# Altium project PocketPlayer.PrjPcb
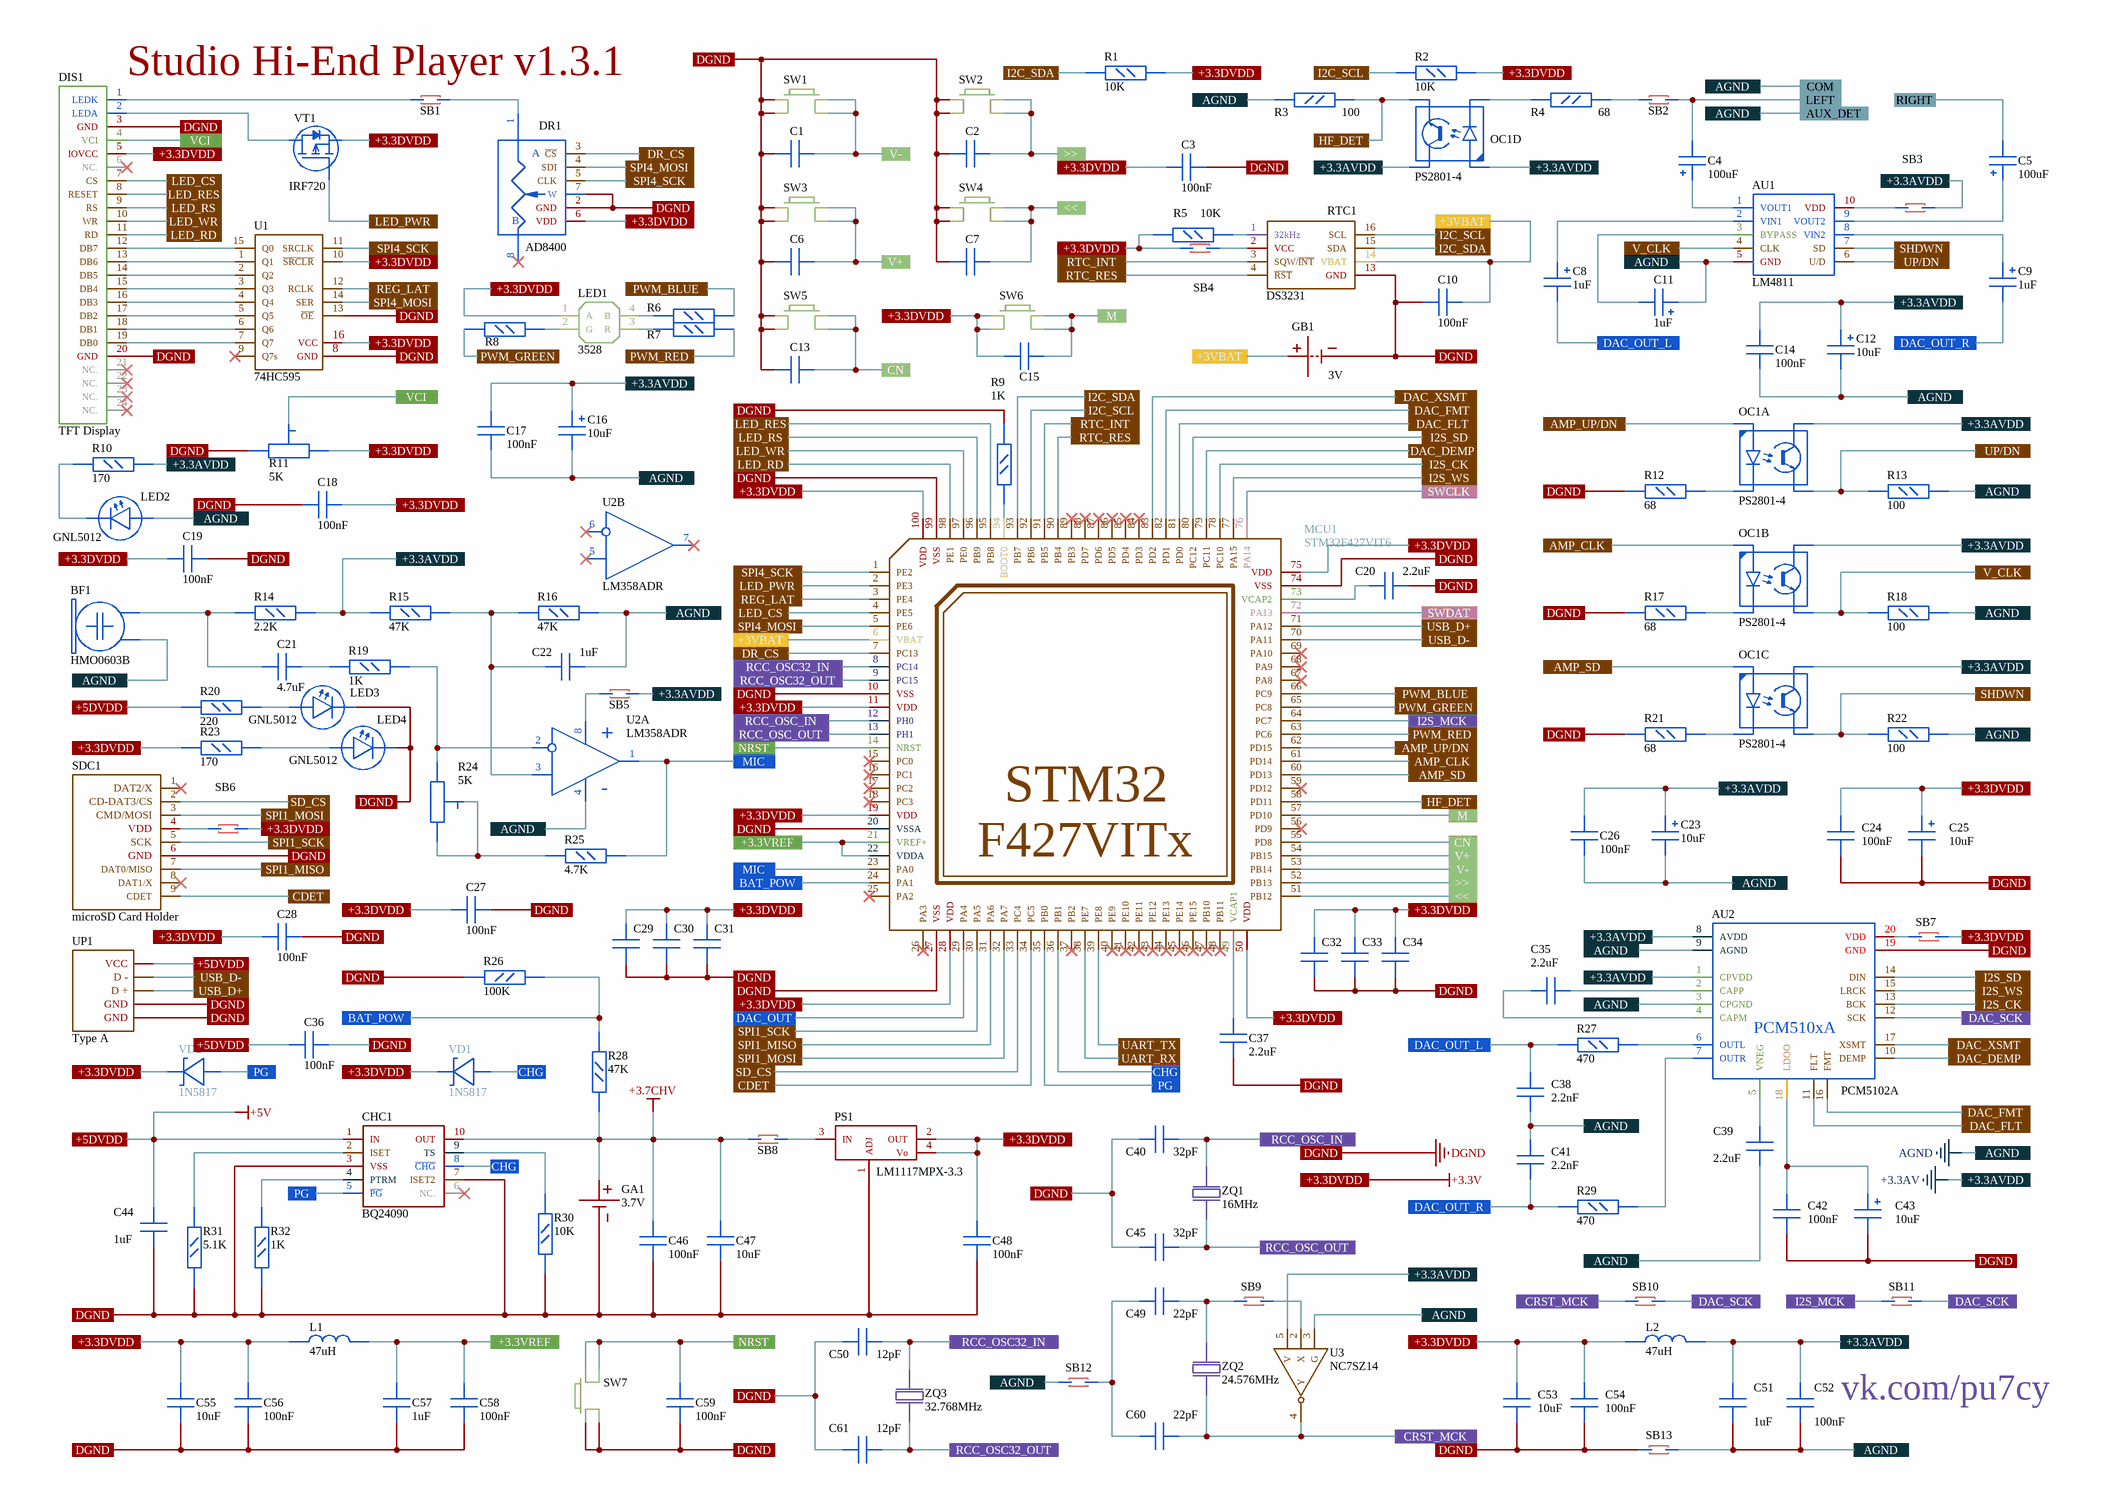
[diagram p0: pPsch.SchDoc]
1 sheet, 142 parts. Net scope: flat (ports and power ports of the same name join across sheets).
Board file: pPPCB.PcbDoc

## Sheet pPsch.SchDoc
size A3; SheetNumber: 1; SheetTotal: 2

### Parts
AU1  LM4811  [HVSSOP10]
AU2  PCM5102A  [TSSOP20]
BF1  HMO0603B  [ACCUM]
C1  100nF  [C0603]  (value not drawn)
C2  100nF  [C0603]  (value not drawn)
C3  100nF  [C0603]
C4  100uF  [CAP_TAN-C]
C5  100uF  [CAP_TAN-C]
C6  100nF  [C0603]  (value not drawn)
C7  100nF  [C0603]  (value not drawn)
C8  1uF  [CAP_TAN-A]
C9  1uF  [CAP_TAN-A]
C10  100nF  [C0603]
C11  1uF  [CAP_TAN-A]
C12  10uF  [CAP_TAN-A]
C13  100nF  [C0603]  (value not drawn)
C14  100nF  [C0603]
C15  100nF  [C0603]  (value not drawn)
C16  10uF  [CAP_TAN-A]
C17  100nF  [C0603]
C18  100nF  [C0603]
C19  100nF  [C0603]
C20  2.2uF  [C0805]
C21  4.7uF  [C0805]
C22  1uF  [C0805]
C23  10uF  [CAP_TAN-A]
C24  100nF  [C0603]
C25  10uF  [CAP_TAN-A]
C26  100nF  [C0603]
C27  100nF  [C0603]
C28  100nF  [C0603]
C29  100nF  [C0603]  (value not drawn)
C30  100nF  [C0603]  (value not drawn)
C31  100nF  [C0603]  (value not drawn)
C32  100nF  [C0603]  (value not drawn)
C33  100nF  [C0603]  (value not drawn)
C34  100nF  [C0603]  (value not drawn)
C35  2.2uF  [C0805]
C36  100nF  [C0603]
C37  2.2uF  [C0805]
C38  2.2nF  [C0603]
C39  2.2uF  [C0805]
C40  32pF  [C0402]
C41  2.2nF  [C0603]
C42  100nF  [C0603]
C43  10uF  [CAP_TAN-A]
C44  1uF  [C0805]
C45  32pF  [C0402]
C46  100nF  [C0603]
C47  10uF  [C0805]
C48  100nF  [C0603]
C49  22pF  [C0402]
C50  12pF  [C0402]
C51  1uF  [C0805]
C52  100nF  [C0603]
C53  10uF  [C0805]
C54  100nF  [C0603]
C55  10uF  [C0805]
C56  100nF  [C0603]
C57  1uF  [C0805]
C58  100nF  [C0603]
C59  100nF  [C0603]
C60  22pF  [C0402]
C61  12pF  [C0402]
CHC1  BQ24090  [HVSSOP10]
DIS1  TFT Display  [FPC-24]
DR1  AD8400  [SOIC8]
GA1  3.7V  [ACCUM]
GB1  3V  [CR1616-SMD]
L1  47uH  [L0805]
L2  47uH  [L0805]
LED1  3528  [LED-3528]
LED2  GNL5012  [LED0603]
LED3  GNL5012  [LED0603]
LED4  GNL5012  [LED0603]
MCU1  STM32F427VIT6  [LQFP100]
OC1  PS2801-4  [SSOP16]  (parts A,B,C,D of 4)
PS1  LM1117MPX-3.3  [SOT-223]
R1  10K  [R0603]
R2  10K  [R0603]
R3  100  [R0805]
R4  68  [R0805]
R5  10K  [R0603]
R6  220  [R0603]  (value not drawn)
R7  220  [R0603]  (value not drawn)
R8  220  [R0603]  (value not drawn)
R9  1K  [R0603]
R10  170  [R0805]
R11  5K  [EVM3]
R12  68  [R0805]
R13  100  [R0805]
R14  2.2K  [R0603]
R15  47K  [R0603]
R16  47K  [R0603]
R17  68  [R0805]
R18  100  [R0805]
R19  1K  [R0603]
R20  220  [R0805]
R21  68  [R0805]
R22  100  [R0805]
R23  170  [R0805]
R24  5K  [EVM3]
R25  4.7K  [R0603]
R26  100K  [R0603]
R27  470  [R0603]
R28  47K  [R0603]
R29  470  [R0603]
R30  10K  [R0603]
R31  5.1K  [R0603]
R32  1K  [R0603]
RTC1  DS3231  [SOP16]
SB1  Soldier Bridge  [SOLDBR]  (value not drawn)
SB2  Soldier Bridge  [SOLDBR]  (value not drawn)
SB3  Soldier Bridge  [SOLDBR]  (value not drawn)
SB4  Soldier Bridge  [SOLDBR]  (value not drawn)
SB5  Soldier Bridge  [SOLDBR]  (value not drawn)
SB6  Soldier Bridge  [SOLDBR]  (value not drawn)
SB7  Soldier Bridge  [SOLDBR]  (value not drawn)
SB8  Soldier Bridge  [SOLDBR]  (value not drawn)
SB9  Soldier Bridge  [SOLDBR]  (value not drawn)
SB10  Soldier Bridge  [SOLDBR]  (value not drawn)
SB11  Soldier Bridge  [SOLDBR]  (value not drawn)
SB12  Soldier Bridge  [SOLDBR]  (value not drawn)
SB13  Soldier Bridge  [SOLDBR]  (value not drawn)
SDC1  microSD Card Holder  [SDCARD-MICRO]
SW1  KLS7-TS6601  [BUT-SMD-6X6-8X6.2]  (value not drawn)
SW2  KLS7-TS6601  [BUT-SMD-6X6-8X6.2]  (value not drawn)
SW3  KLS7-TS6601  [BUT-SMD-6X6-8X6.2]  (value not drawn)
SW4  KLS7-TS6601  [BUT-SMD-6X6-8X6.2]  (value not drawn)
SW5  KLS7-TS6601  [BUT-SMD-6X6-8X6.2]  (value not drawn)
SW6  KLS7-TS6601  [BUT-SMD-3X4-C]  (value not drawn)
SW7  KLS7-TS6601  [BUT-SMD-6X6-8X6.2]  (value not drawn)
U1  74HC595  [TSSOP16]
U2  LM358ADR  [SOIC8]  (parts A,B of 2)
U3  NC7SZ14  [SOT23-5]
UP1  Type A  [USB-MICRO-F]
VD1  1N5817  [AXIAL10D-TR]
VD2  1N5817  [AXIAL10D-TR]
VT1  IRF720  [TO-220V]
ZQ1  16MHz  [CRYSTALL-SMD]
ZQ2  24.576MHz  [HC-49]
ZQ3  32.768MHz  [NX3215SA]

### Ports
+3.3AVDD, +3.3DVDD, +3.3VREF, +3VBAT, +5DVDD, <<, >>, AGND, AMP_CLK, AMP_SD, AMP_UP/DN, AUX_DET, BAT_POW, CDET, CHG, CN, COM, CRST_MCK, DAC_DEMP, DAC_FLT, DAC_FMT, DAC_OUT, DAC_OUT_L, DAC_OUT_R, DAC_SCK, DAC_XSMT, DGND, DR_CS, HF_DET, I2C_SCL, I2C_SDA, I2S_CK, I2S_MCK, I2S_SD, I2S_WS, LED_CS, LED_PWR, LED_RD, LED_RES, LED_RS, LED_WR, LEFT, M, MIC, NRST, PG, PWM_BLUE, PWM_GREEN, PWM_RED, RCC_OSC32_IN, RCC_OSC32_OUT, RCC_OSC_IN, RCC_OSC_OUT, REG_LAT, RIGHT, RTC_INT, RTC_RES, SD_CS, SHDWN, SPI1_MISO, SPI1_MOSI, SPI1_SCK, SPI4_MOSI, SPI4_SCK, SWCLK, SWDAT, UART_RX, UART_TX, UP/DN, USB_D+, USB_D-, V+, V-, V_CLK, VCI

### Nets
+3.3AV: AU2.1(CPVDD) AU2.8(AVDD) C12.1 C14.2 C16.1 C17.2 C23.1 C26.2 C51.2 C52.2 L2.2 OC1.7 OC1.10 OC1.12 OC1.14 OC1.16 R10.2 R14.2 R15.2 SB3.2 SB5.2 U3.5(V) ; port +3.3AVDD
+3.3V: C3.1 C15.1 C18.1 C19.1 C24.2 C25.1 C27.1 C28.1 C29.2 C30.2 C31.2 C32.2 C33.2 C34.2 C48.2 C53.2 C54.2 C55.2 C56.2 DIS1.5(IOVCC) DR1.6(VDD) L1.1 L2.1 LED1.1(A) MCU1.11(VDD) MCU1.19(VDD) MCU1.28(VDD) MCU1.50(VDD) MCU1.75(VDD) MCU1.100(VDD) PS1.2(OUT) PS1.4(Vo) R1.2 R2.2 R5.1 R11.3 R23.1 SB4.1 SB6.2 SB7.2 SW6.1(Q1) SW6.2(Q1) U1.10(~{SRCLR}) U1.16(VCC) VD1.2 VD2.2 VT1.3(S) ; port +3.3DVDD
+3.7CHV: C46.2 C47.2 CHC1.10(OUT) GA1.1 R28.2 SB8.1
+5V: C36.1 C44.2 CHC1.1(IN) R20.1 UP1.1(VCC) ; port +5DVDD
AGND: AU1.5(GND) AU2.3(CPGND) AU2.9(AGND) BF1.1 C11.1 C12.2 C14.1 C16.2 C17.1 C22.2 C23.2 C26.1 C38.1 C39.2 C41.2 C51.1 C52.1 LED2.1 R3.2 R13.2 R16.1 R18.2 R22.2 SB12.1 SB13.2 U2.4(-) U3.3(G) ; port AGND, port AUX_DET, port COM
DGND: AU2.19(GND) C1.2 C2.2 C3.2 C6.2 C7.2 C10.1 C13.2 C18.2 C19.2 C20.1 C24.1 C25.2 C27.2 C28.2 C29.1 C30.1 C31.1 C32.1 C33.1 C34.1 C36.2 C37.1 C40.2 C42.1 C43.2 C44.1 C45.2 C46.1 C47.1 C48.1 C50.2 C53.1 C54.1 C55.1 C56.1 C57.1 C58.1 C59.1 C61.2 CHC1.3(VSS) CHC1.7(ISET2) DIS1.3(GND) DIS1.20(GND) DR1.2(GND) DR1.7(W) GA1.2(+) GB1.1(+) LED3.2 LED4.2 MCU1.10(VSS) MCU1.20(VSSA) MCU1.27(VSS) MCU1.74(VSS) MCU1.99(VSS) PS1.1(ADJ) R9.2 R11.1 R12.1 R17.1 R21.1 R26.1 R30.1 R31.1 R32.2 RTC1.13(GND) SB13.1 SDC1.6(GND) SW1.1(Q1) SW1.2(Q1) SW2.1(Q1) SW2.2(Q1) SW3.1(Q1) SW3.2(Q1) SW4.1(Q1) SW4.2(Q1) SW5.1(Q1) SW5.2(Q1) SW7.1(Q1) SW7.2(Q1) U1.8(GND) U1.13(~{OE}) UP1.4(GND) UP1.5(GND) ; port DGND
NetAU1_1: AU1.1(VOUT1) C4.1
NetAU1_2: AU1.2(VIN1) C8.1
NetAU1_3: AU1.3(BYPASS) C11.2
NetAU1_4: AU1.4(CLK) OC1.13 R18.1 ; port V_CLK
NetAU1_6: AU1.6(U/D) OC1.15 R13.1 ; port UP/DN
NetAU1_7: AU1.7(SD) OC1.11 R22.1 ; port SHDWN
NetAU1_8: AU1.8(VIN2) C9.1
NetAU1_9: AU1.9(VOUT2) C5.1
NetAU1_10: AU1.10(VDD) SB3.1
NetAU2_2: AU2.2(CAPP) C35.1
NetAU2_4: AU2.4(CAPM) C35.2
NetAU2_5: AU2.5(VNEG) C39.1
NetAU2_6: AU2.6(OUTL) R27.2
NetAU2_7: AU2.7(OUTR) R29.2
NetAU2_10: AU2.10(DEMP) MCU1.79(PC11) ; port DAC_DEMP
NetAU2_11: AU2.11(FLT) MCU1.81(PD0) ; port DAC_FLT
NetAU2_12: AU2.12(SCK) SB10.2 SB11.2 ; port DAC_SCK
NetAU2_13: AU2.13(BCK) MCU1.78(PC10) ; port I2S_CK
NetAU2_14: AU2.14(DIN) MCU1.80(PC12) ; port I2S_SD
NetAU2_15: AU2.15(LRCK) MCU1.77(PA15) ; port I2S_WS
NetAU2_16: AU2.16(FMT) MCU1.82(PD1) ; port DAC_FMT
NetAU2_17: AU2.17(XSMT) MCU1.83(PD2) ; port DAC_XSMT
NetAU2_18: AU2.18(LDOO) C42.2 C43.1
NetAU2_20: AU2.20(VDD) SB7.1
NetBF1_2: BF1.2 C21.2 R14.1
NetC1_1: C1.1 MCU1.53(PB14) SW1.3(Q2) SW1.4(Q2) ; port V-
NetC2_1: C2.1 MCU1.52(PB13) SW2.3(Q2) SW2.4(Q2) ; port >>
NetC4_2: C4.2 SB2.2 ; port LEFT
NetC5_2: C5.2 ; port RIGHT
NetC6_1: C6.1 MCU1.54(PB15) SW3.3(Q2) SW3.4(Q2) ; port V+
NetC7_1: C7.1 MCU1.51(PB12) SW4.3(Q2) SW4.4(Q2) ; port <<
NetC8_2: C8.2 C38.2 R27.1 ; port DAC_OUT_L
NetC9_2: C9.2 C41.1 R29.1 ; port DAC_OUT_R
NetC10_2: C10.2 GB1.2 MCU1.6(VBAT) RTC1.14(VBAT) ; port +3VBAT
NetC13_1: C13.1 MCU1.55(PD8) SW5.3(Q2) SW5.4(Q2) ; port CN
NetC15_2: C15.2 MCU1.57(PD10) SW6.3(Q2) SW6.4(Q2) ; port M
NetC20_2: C20.2 MCU1.73(VCAP2)
NetC21_1: C21.1 R19.2
NetC22_1: C22.1 R15.1 R16.2 U2.3
NetC37_2: C37.2 MCU1.49(VCAP1)
NetC40_1: C40.1 MCU1.12(PH0) ZQ1.1 ; port RCC_OSC_IN
NetC45_1: C45.1 MCU1.13(PH1) ZQ1.2 ; port RCC_OSC_OUT
NetC49_1: C49.1 SB9.1 ZQ2.1
NetC49_2: C49.2 C60.2 SB12.2
NetC50_1: C50.1 MCU1.8(PC14) ZQ3.1 ; port RCC_OSC32_IN
NetC57_2: C57.2 C58.2 L1.2 MCU1.21(VREF+) MCU1.22(VDDA) ; port +3.3VREF
NetC59_2: C59.2 MCU1.14(NRST) SW7.3(Q2) SW7.4(Q2) ; port NRST
NetC60_1: C60.1 SB10.1 U3.4(Y) ZQ2.2 ; port CRST_MCK
NetC61_1: C61.1 MCU1.9(PC15) ZQ3.2 ; port RCC_OSC32_OUT
NetCHC1_2: CHC1.2(ISET) R31.2
NetCHC1_4: CHC1.4(PTRM) R32.1
NetCHC1_5: CHC1.5(~{PG}) MCU1.35(PB0) VD2.1 ; port PG
NetCHC1_8: CHC1.8(~{CHG}) MCU1.36(PB1) VD1.1 ; port CHG
NetCHC1_9: CHC1.9(TS) R30.2
NetDIS1_1: DIS1.1(LEDK) SB1.2
NetDIS1_2: DIS1.2(LEDA) VT1.2(D)
NetDIS1_4: DIS1.4(VCI) R11.2 ; port VCI
NetDIS1_7: DIS1.7(CS) MCU1.4(PE5) ; port LED_CS
NetDIS1_8: DIS1.8(RESET) MCU1.95(PB8) ; port LED_RES
NetDIS1_9: DIS1.9(RS) MCU1.96(PB9) ; port LED_RS
NetDIS1_10: DIS1.10(WR) MCU1.97(PE0) ; port LED_WR
NetDIS1_11: DIS1.11(RD) MCU1.98(PE1) ; port LED_RD
NetDIS1_12: DIS1.12(DB7) U1.15(Q0)
NetDIS1_13: DIS1.13(DB6) U1.1(Q1)
NetDIS1_14: DIS1.14(DB5) U1.2(Q2)
NetDIS1_15: DIS1.15(DB4) U1.3(Q3)
NetDIS1_16: DIS1.16(DB3) U1.4(Q4)
NetDIS1_17: DIS1.17(DB2) U1.5(Q5)
NetDIS1_18: DIS1.18(DB1) U1.6(Q6)
NetDIS1_19: DIS1.19(DB0) U1.7(Q7)
NetDR1_1: DR1.1 SB1.1
NetDR1_3: DR1.3(~{CS}) MCU1.7(PC13) ; port DR_CS
NetDR1_4: DR1.4(SDI) MCU1.5(PE6) U1.14(SER) ; port SPI4_MOSI
NetDR1_5: DR1.5(CLK) MCU1.1(PE2) U1.11(SRCLK) ; port SPI4_SCK
NetLED1_2: LED1.2(G) R8.2
NetLED1_3: LED1.3(R) R7.1
NetLED1_4: LED1.4(B) R6.1
NetLED2_2: LED2.2 R10.1
NetLED3_1: LED3.1 R20.2
NetLED4_1: LED4.1 R23.2
NetMCU1_2: MCU1.2(PE3) VT1.1(G) ; port LED_PWR
NetMCU1_3: MCU1.3(PE4) U1.12(RCLK) ; port REG_LAT
NetMCU1_23: MCU1.23(PA0) R25.2 U2.1 ; port MIC
NetMCU1_24: MCU1.24(PA1) R26.2 R28.1 ; port BAT_POW
NetMCU1_29: MCU1.29(PA4) ; port DAC_OUT
NetMCU1_30: MCU1.30(PA5) SDC1.5(SCK) ; port SPI1_SCK
NetMCU1_31: MCU1.31(PA6) SDC1.7(DAT0/MISO) ; port SPI1_MISO
NetMCU1_32: MCU1.32(PA7) SDC1.3(CMD/MOSI) ; port SPI1_MOSI
NetMCU1_33: MCU1.33(PC4) SDC1.2(CD-DAT3/CS) ; port SD_CS
NetMCU1_34: MCU1.34(PC5) SDC1.9(CDET) ; port CDET
NetMCU1_38: MCU1.38(PE7) ; port UART_RX
NetMCU1_39: MCU1.39(PE8) ; port UART_TX
NetMCU1_58: MCU1.58(PD11) OC1.9 R3.1 ; port HF_DET
NetMCU1_60: MCU1.60(PD13) OC1.5 ; port AMP_SD
NetMCU1_61: MCU1.61(PD14) OC1.3 ; port AMP_CLK
NetMCU1_62: MCU1.62(PD15) OC1.1 ; port AMP_UP/DN
NetMCU1_63: MCU1.63(PC6) R7.2 ; port PWM_RED
NetMCU1_64: MCU1.64(PC7) SB11.1 ; port I2S_MCK
NetMCU1_65: MCU1.65(PC8) R8.1 ; port PWM_GREEN
NetMCU1_66: MCU1.66(PC9) R6.2 ; port PWM_BLUE
NetMCU1_70: MCU1.70(PA11) UP1.2(D_-) ; port USB_D-
NetMCU1_71: MCU1.71(PA12) UP1.3(D_+) ; port USB_D+
NetMCU1_72: MCU1.72(PA13) ; port SWDAT
NetMCU1_76: MCU1.76(PA14) ; port SWCLK
NetMCU1_90: MCU1.90(PB4) RTC1.4(~{RST}) ; port RTC_RES
NetMCU1_91: MCU1.91(PB5) RTC1.3(SQW/~{INT}) ; port RTC_INT
NetMCU1_92: MCU1.92(PB6) R2.1 RTC1.16(SCL) ; port I2C_SCL
NetMCU1_93: MCU1.93(PB7) R1.1 RTC1.15(SDA) ; port I2C_SDA
NetMCU1_94: MCU1.94(BOOT0) R9.1
NetOC1_2: OC1.2 R12.2
NetOC1_4: OC1.4 R17.2
NetOC1_6: OC1.6 R21.2
NetOC1_8: OC1.8 R4.2
NetPS1_3: PS1.3(IN) SB8.2
NetR4_1: R4.1 SB2.1
NetR5_2: R5.2 RTC1.1(32kHz)
NetR19_1: R19.1 R24.1 U2.2(-)
NetR24_2: R24.2 R24.3 R25.1
NetRTC1_2: RTC1.2(VCC) SB4.2
NetSB5_1: SB5.1 U2.8(+)
NetSB6_1: SB6.1 SDC1.4(VDD)
NetSB9_2: SB9.2 U3.2(X)

Not connected (* = marked no-connect by the designer): CHC1 6(NC.)*; DIS1 6(NC.)* 21(NC.)* 22(NC.)* 23(NC.)* 24(NC.)*; DR1 8*; MCU1 15(PC0)* 16(PC1)* 17(PC2)* 18(PC3)* 25(PA2)* 26(PA3)* 37(PB2)* 40(PE9)* 41(PE10)* 42(PE11)* 43(PE12)* 44(PE13)* 45(PE14)* 46(PE15)* 47(PB10)* 48(PB11)* 56(PD9)* 59(PD12)* 67(PA8)* 68(PA9)* 69(PA10)* 84(PD3)* 85(PD4)* 86(PD5)* 87(PD6)* 88(PD7)* 89(PB3)*; SDC1 1(DAT2/X)* 8(DAT1/X)*; U1 9(Q7s)*; U2 5* 6(-)* 7*

### Notes on the sheet
- (near SB1) Studio Hi-End Player v1.3.1
- (near C52) vk.com/pu7cy
- (in symbol AD8400) A; B
- (in symbol STM32F427VITx) STM32; F427VITx

### Library data of the parts
AU2 = PCM510xA: Name: PCM5102A
BF1 = Microphone: Name: HMO0603B
C1-C3 C6 C7 C10 C13-C15 C17-C22 C24 C26-C42 C44-C61 = Cap
  C1-C3 C6 C7 C10 C13-C15 C17-C19 C24 C26-C34 C36 C42 C46 C48 C52 C54 C56 C58 C59: Value: 100nF
  C20 C35 C37 C39: Value: 2.2uF
  C21: Value: 4.7uF
  C22 C44 C51 C57: Value: 1uF
  C38 C41: Value: 2.2nF
  C40 C45: Value: 32pF
  C47 C53 C55: Value: 10uF
  C49 C60: Value: 22pF
  C50 C61: Value: 12pF
C4 C5 C8 C9 C11 C12 C16 C23 C25 C43 = Cap_Pol
  C4 C5: Value: 100uF
  C8 C9 C11: Value: 1uF
  C12 C16 C23 C25 C43: Value: 10uF
DIS1 = TFT RGB (ST7789/ILI9341): Name: TFT Display
GA1 = Accumulator: Name: LP; Value: 3.7V
GB1 = Battery: Value: 3V; Type: CR1616
L1 L2 = Inductor: Value: 47uH
LED1 = LED-RGB: Name: 3528
LED2-LED4 = LED: Name: GNL5012
MCU1 = STM32F427VITx: Frequency: 180 MHz; RAM: 256 kBytes; Flash: 2048 kBytes; Name: STM32F427VIT6
PS1 = LM1117: Name: LM1117MPX-3.3
R1-R10 R12-R23 R25-R32 = Res
  R1 R2 R5 R30: Value: 10K
  R3 R13 R18 R22: Value: 100
  R4 R12 R17 R21: Value: 68
  R6-R8 R20: Value: 220
  R9 R19 R32: Value: 1K
  R10 R23: Value: 170
  R14: Value: 2.2K
  R15 R16 R28: Value: 47K
  R25: Value: 4.7K
  R26: Value: 100K
  R27 R29: Value: 470
  R31: Value: 5.1K
R11 R24 = Res Adj: Value: 5K
SB1-SB13 = Soldier Bridge: l: 10K
SDC1 = SPI_Card_Reader: Name: microSD Card Holder; Type: microSD
SW1-SW7 = Button_2: Name: KLS7-TS6601
U1 = 74HC595 (REG): Name: 74HC595
U2 = LM358: Name: LM358ADR
U3 = NOT: Name: NC7SZ14
UP1 = USB: Type: Type A
VD1 VD2 = Schottky: Name: 1N5817
VT1 = MOSFET-P: Name: IRF720
ZQ1 ZQ3 = Crystall: Name: HC49SM
  ZQ1: Value: 16MHz
  ZQ3: Value: 32.768MHz
ZQ2 = Crystall: Name: HC49S; Value: 24.576MHz
AU1 = LM4811: Name: LM4811
CHC1 = BQ24090: Name: BQ24090
DR1 = AD8400: Name: AD8400
OC1 = PS2801-4: Name: PS2801-4
RTC1 = DS3231: Name: DS3231